# EAGLE schematic pcb1_24V (EAGLE 9.6.2)
Assembly variants: ECU Type I non terminated, b

## Sheet 1 of 6
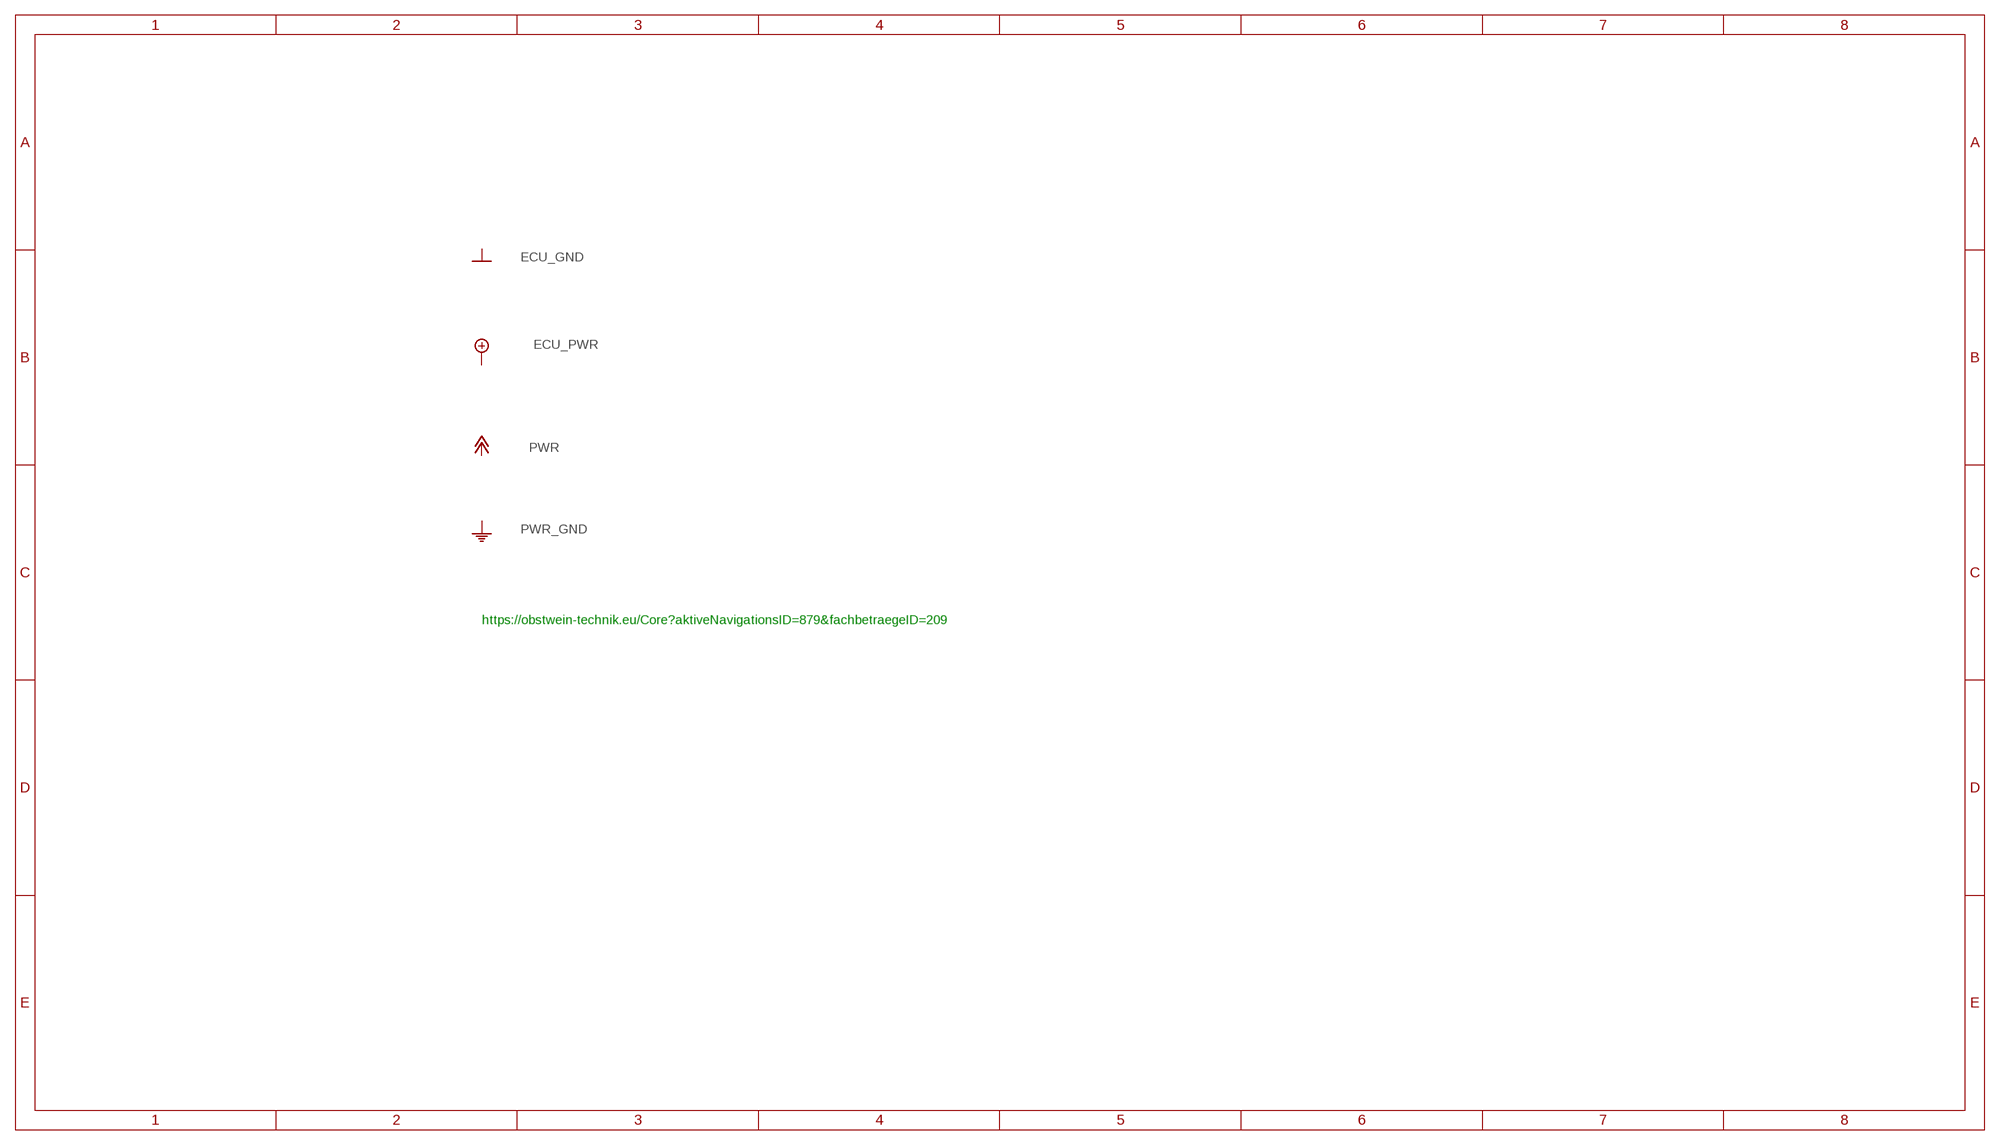
[diagram p0: schematic, sheet 1]

### Notes on the sheet
- https://obstwein-technik.eu/Core?aktiveNavigationsID=879&fachbetraegeID=209

## Sheet 2 of 6
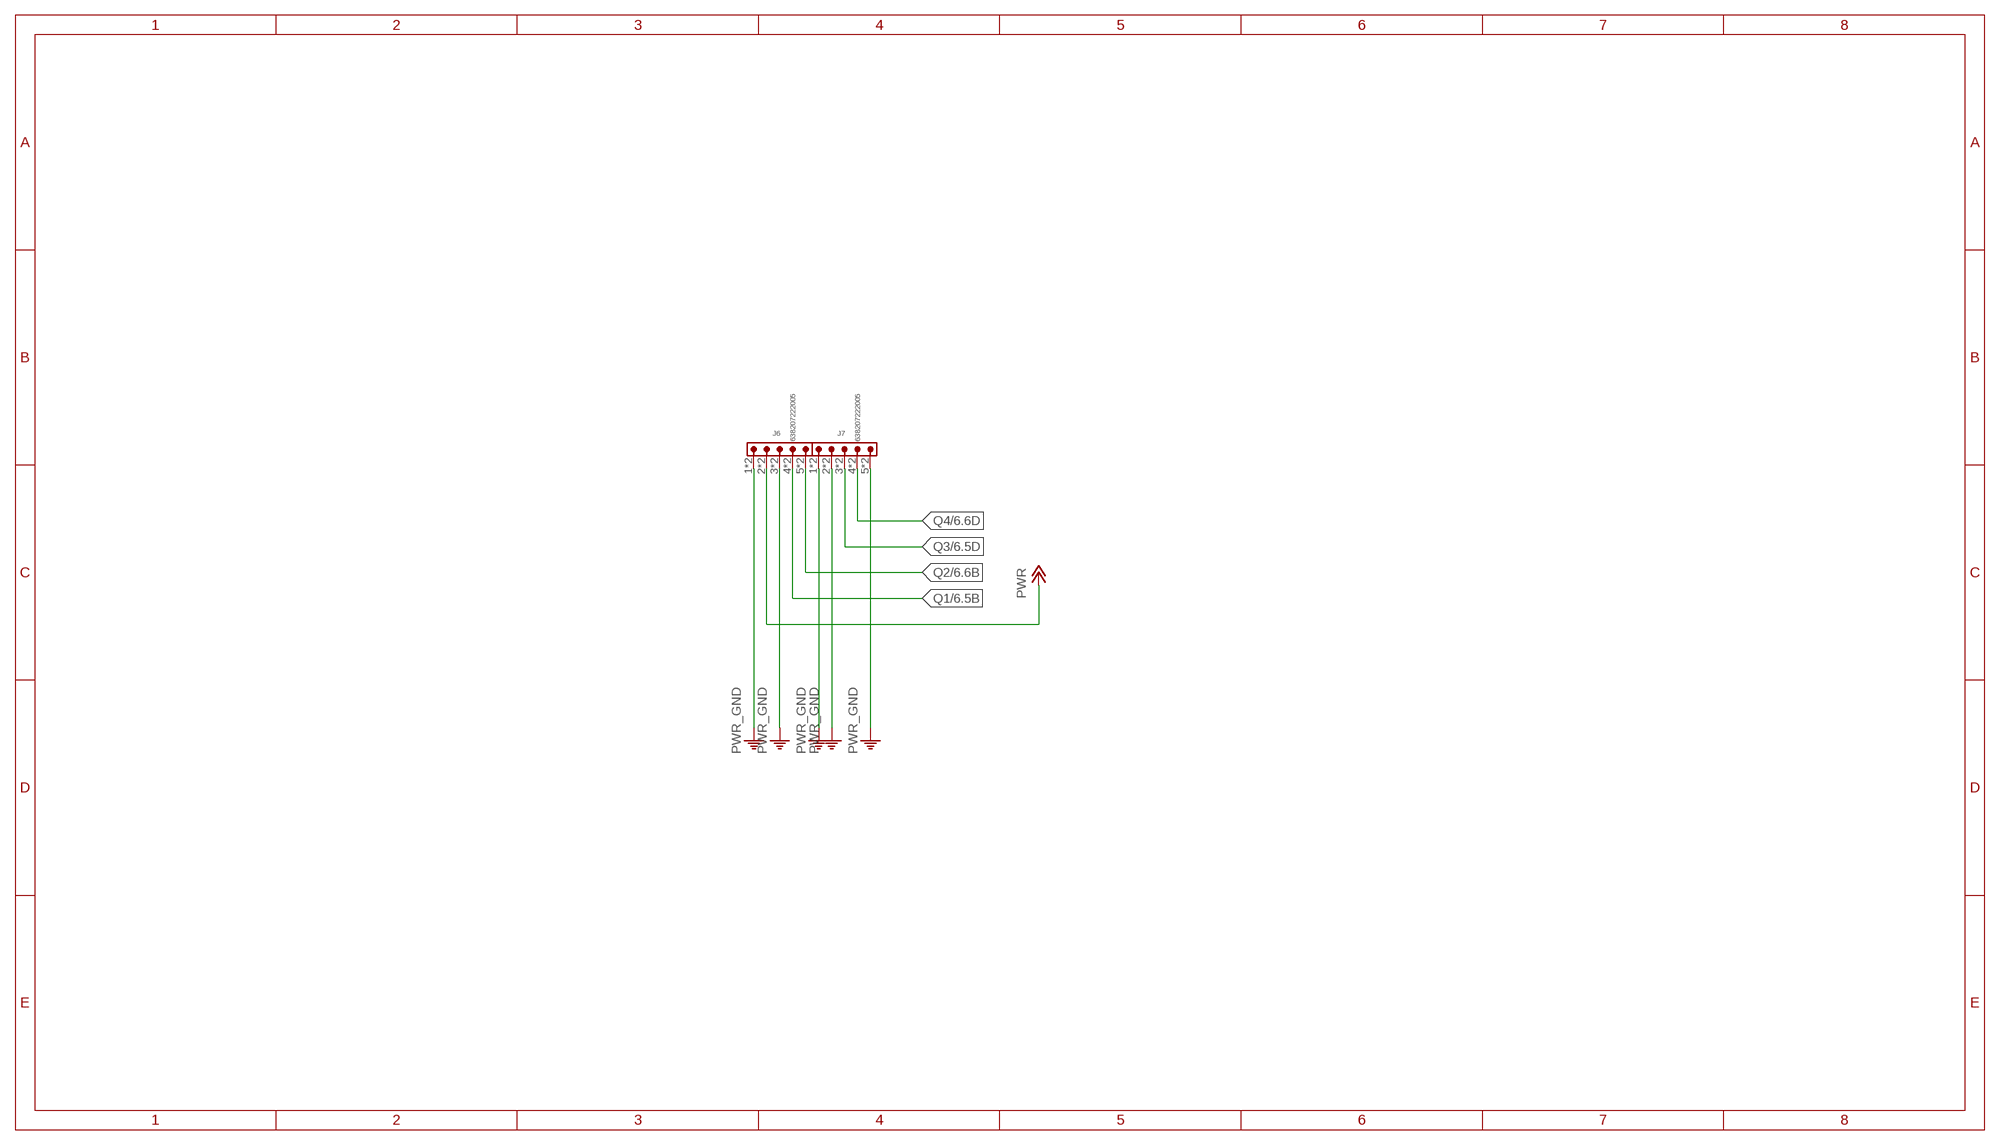
[diagram p1: schematic, sheet 2]

### Parts
J6  638207222005  638207222005  [638207222005]
J7  638207222005  638207222005  [638207222005]

### Nets
PWR: J6.2 J6.A2 ; also sheet 6
PWR_GND: J6.1 J6.3 J6.A1 J6.A3 J7.1 J7.2 J7.5 J7.A1 J7.A2 J7.A5 ; also sheet 6
Q1: J6.4 J6.A4 ; also sheet 6
Q2: J6.5 J6.A5 ; also sheet 6
Q3: J7.3 J7.A3 ; also sheet 6
Q4: J7.4 J7.A4 ; also sheet 6

## Sheet 3 of 6
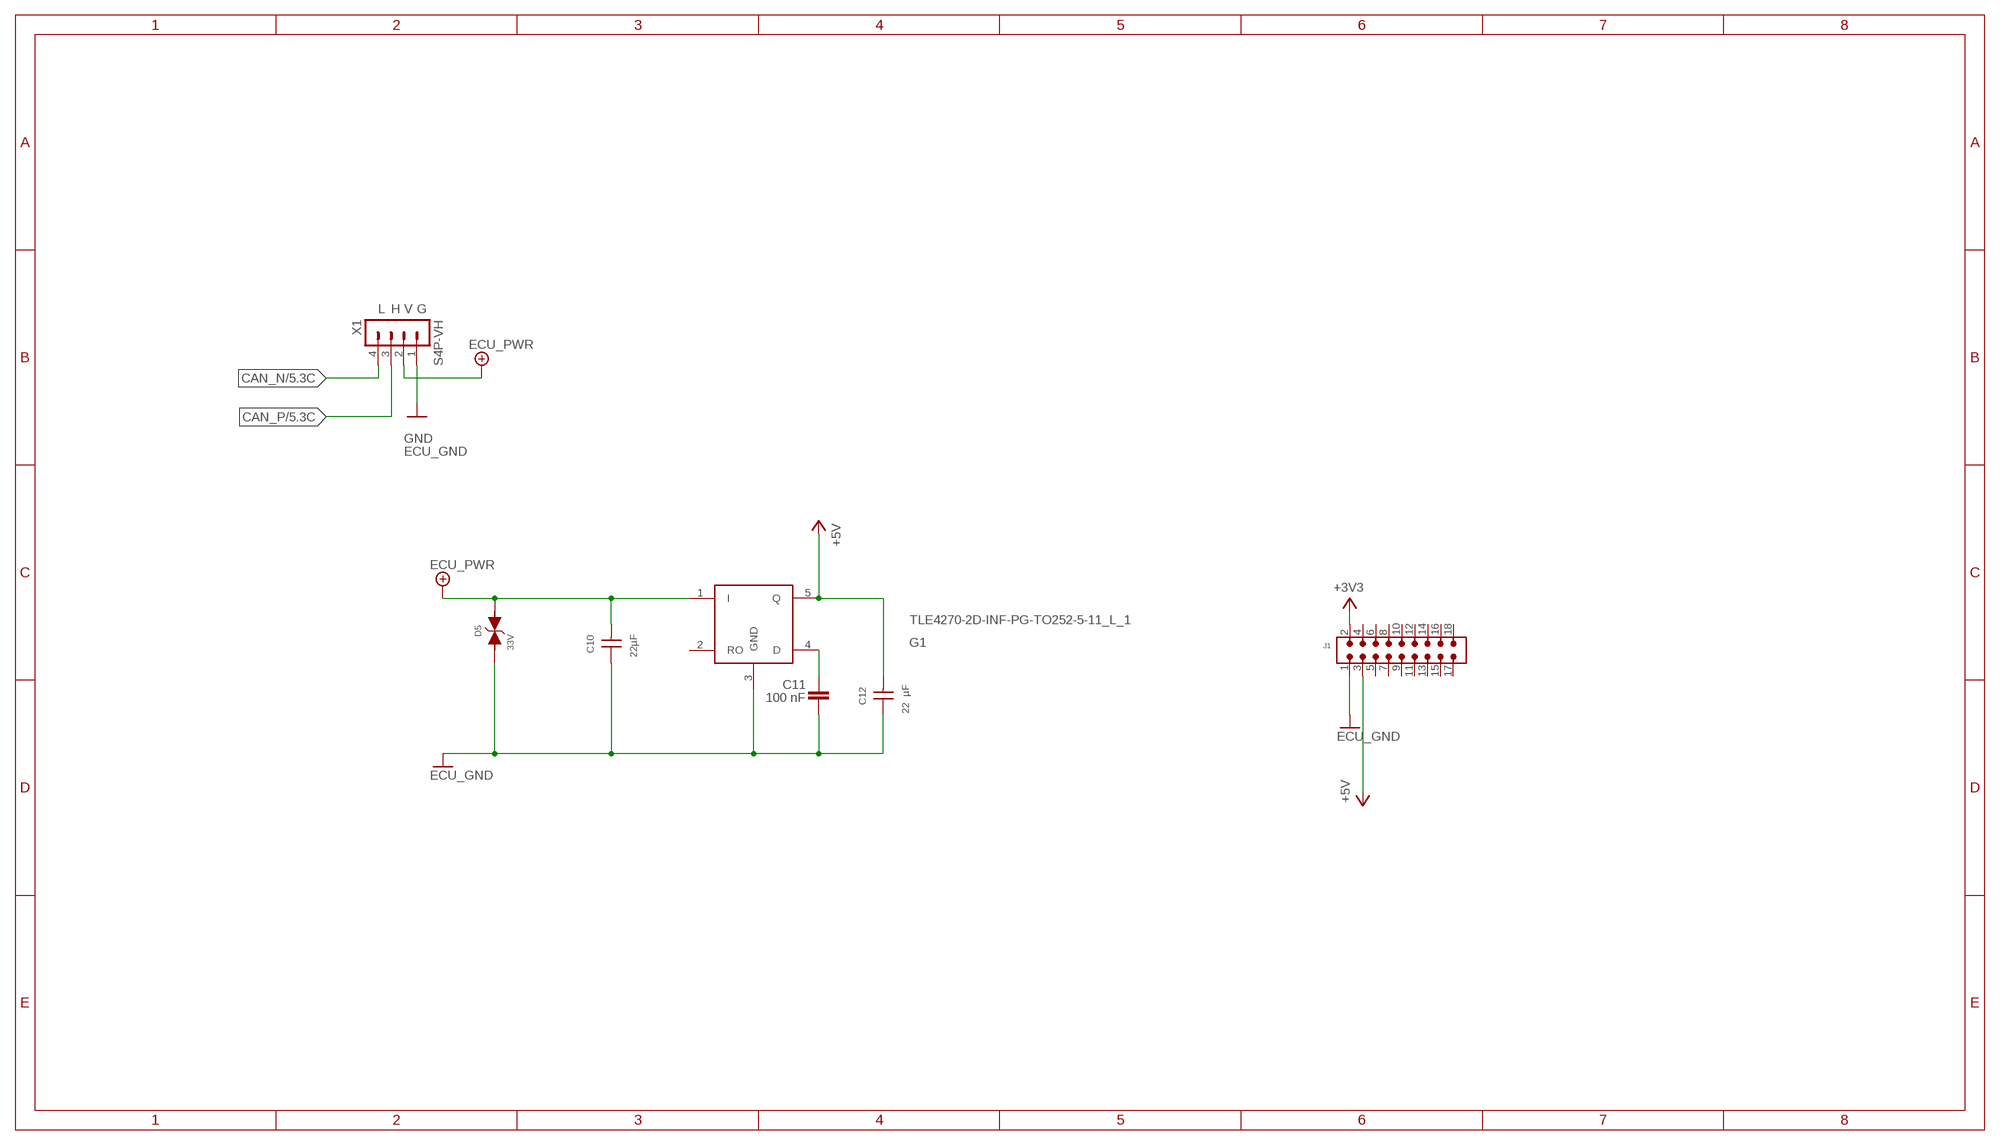
[diagram p2: schematic, sheet 3]

### Parts
C10  22µF  WCAP-CSGP_1210_H2.5_885012109014_25V(DC)  [WCAP-CSGP_1210_H2.5]
C11  100 nF  WCAP-CSGP_0402_885012205037_16V(DC)  [WCAP-CSGP_0402]
C12  22 µF  WCAP-CSGP_0805_H1.25_885012107011_10V(DC)  [WCAP-CSGP_0805_H1.25_R]
D5  33V  WE-TVSP_DO-214AB_3000W_BI_824551331  [WE-TVSP_DO-214AB_BIDIRECTIONAL]
G1  TLE4270-2D-INF-PG-TO252-5-11_L_1  [INF-PG-TO252-5-11_L_1PRIMARY]
J1  6130XX21121_61301821121  [61301821121]
X1  S4P-VH  [S4P-VH]

### Nets
+3V3: J1.2 ; also sheet 4,5
+5V: C12.2 G1.5(Q) J1.3 ; also sheet 4,5
CAN_N: X1.4 ; also sheet 5
CAN_P: X1.3 ; also sheet 5
ECU_GND [GND]: C10.1 C11.2 C12.1 D5.1 G1.3(GND) J1.1 X1.1 ; supply symbol labelled GND ; also sheet 4,5,6
ECU_PWR: C10.2 D5.2 G1.1(I) X1.2 ; also sheet 6
N$7: C11.1 G1.4(D)
Unconnected: G1.2(RO) J1.4 J1.5 J1.6 J1.7 J1.8 J1.9 J1.10 J1.11 J1.12 J1.13 J1.14 J1.15 J1.16 J1.17 J1.18

### Notes on the sheet
- L | H | V | G

## Sheet 4 of 6
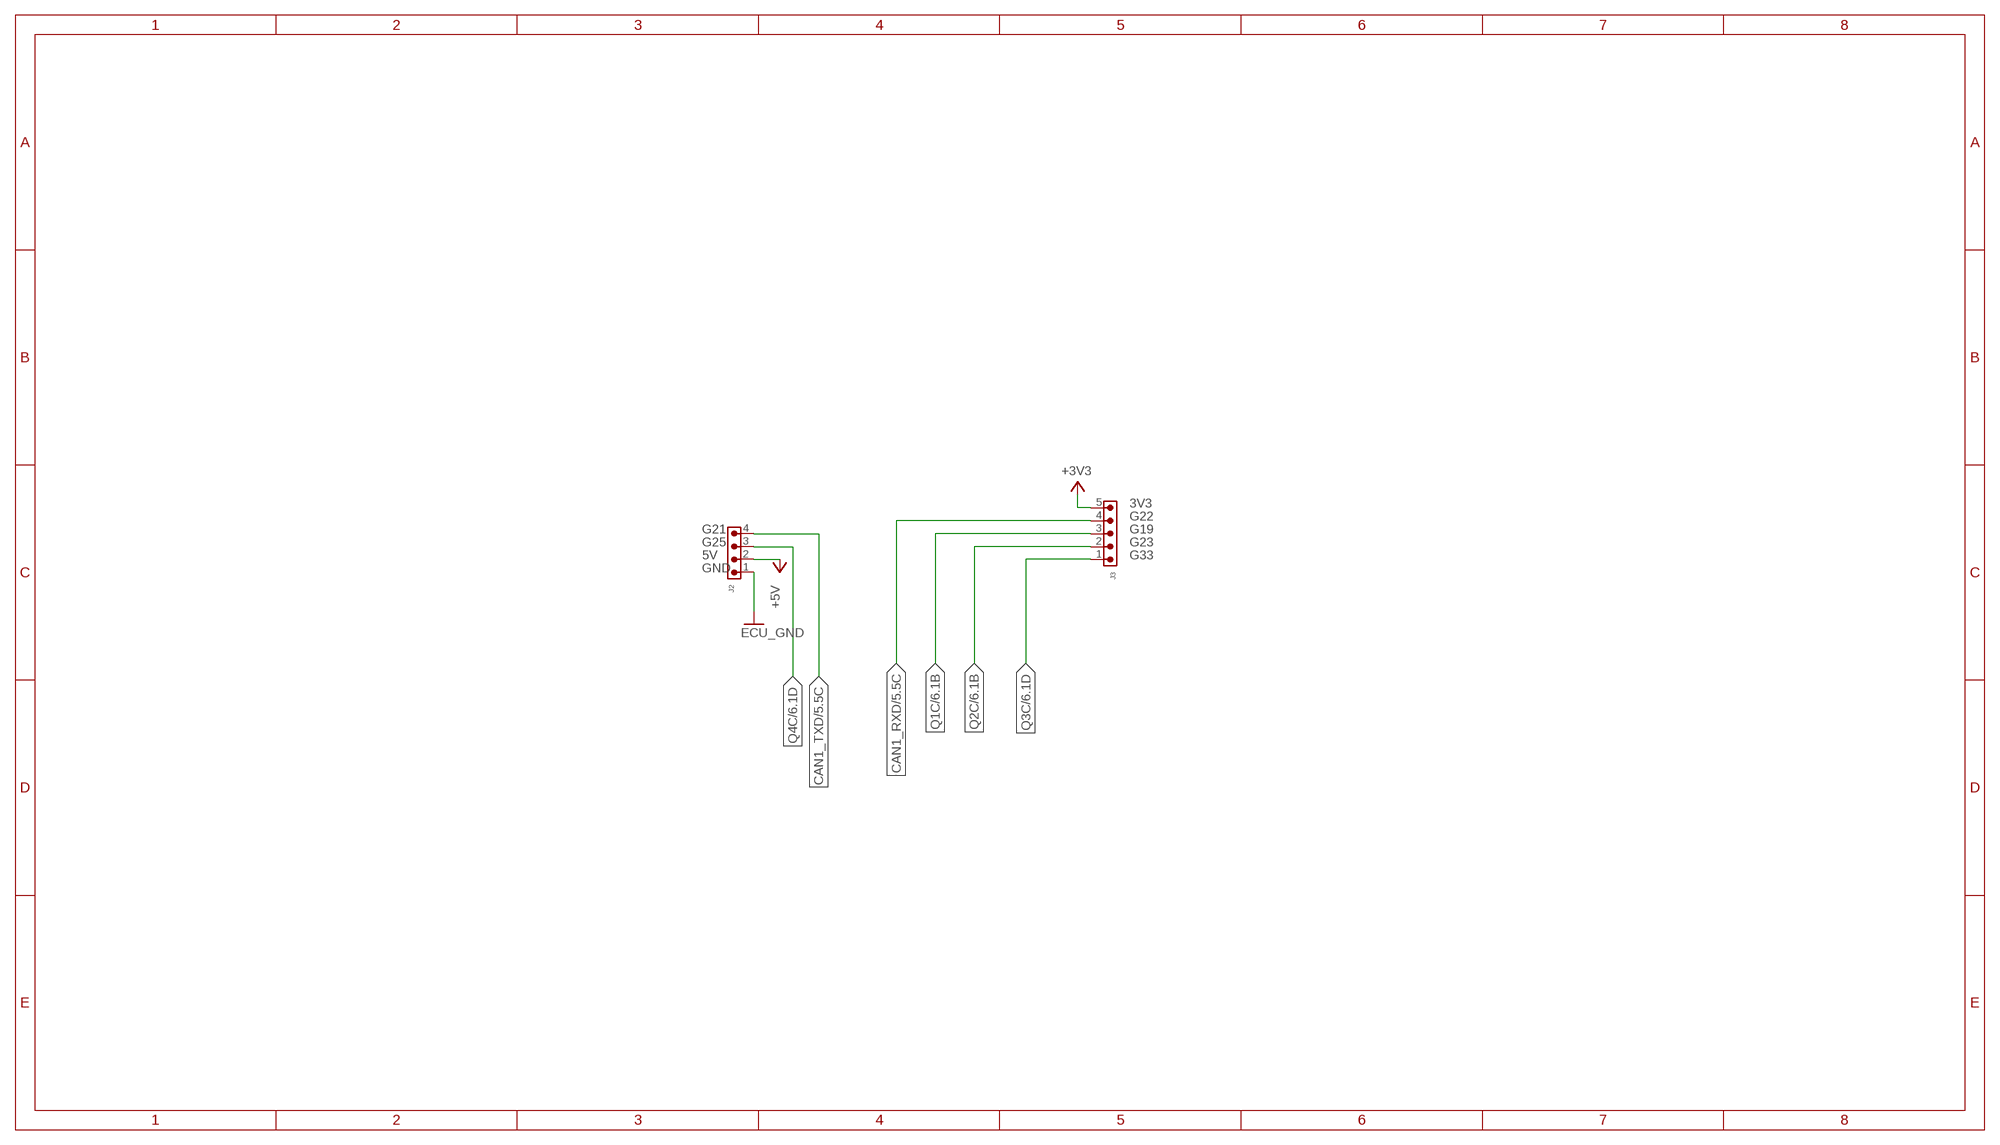
[diagram p3: schematic, sheet 4]

### Parts
J2  6130XX11121_61300411121  [61300411121]
J3  6130XX11121_61300511121  [61300511121]

### Nets
+3V3: J3.5 ; also sheet 3,5
+5V: J2.2 ; also sheet 3,5
CAN1_RXD: J3.4 ; also sheet 5
CAN1_TXD: J2.4 ; also sheet 5
ECU_GND [GND]: J2.1 ; also sheet 3,5,6
Q1C: J3.3 ; also sheet 6
Q2C: J3.2 ; also sheet 6
Q3C: J3.1 ; also sheet 6
Q4C: J2.3 ; also sheet 6

### Notes on the sheet
- 3V3
- G22
- G21 | G19
- G25 | G23
- 5V | G33
- GND

## Sheet 5 of 6
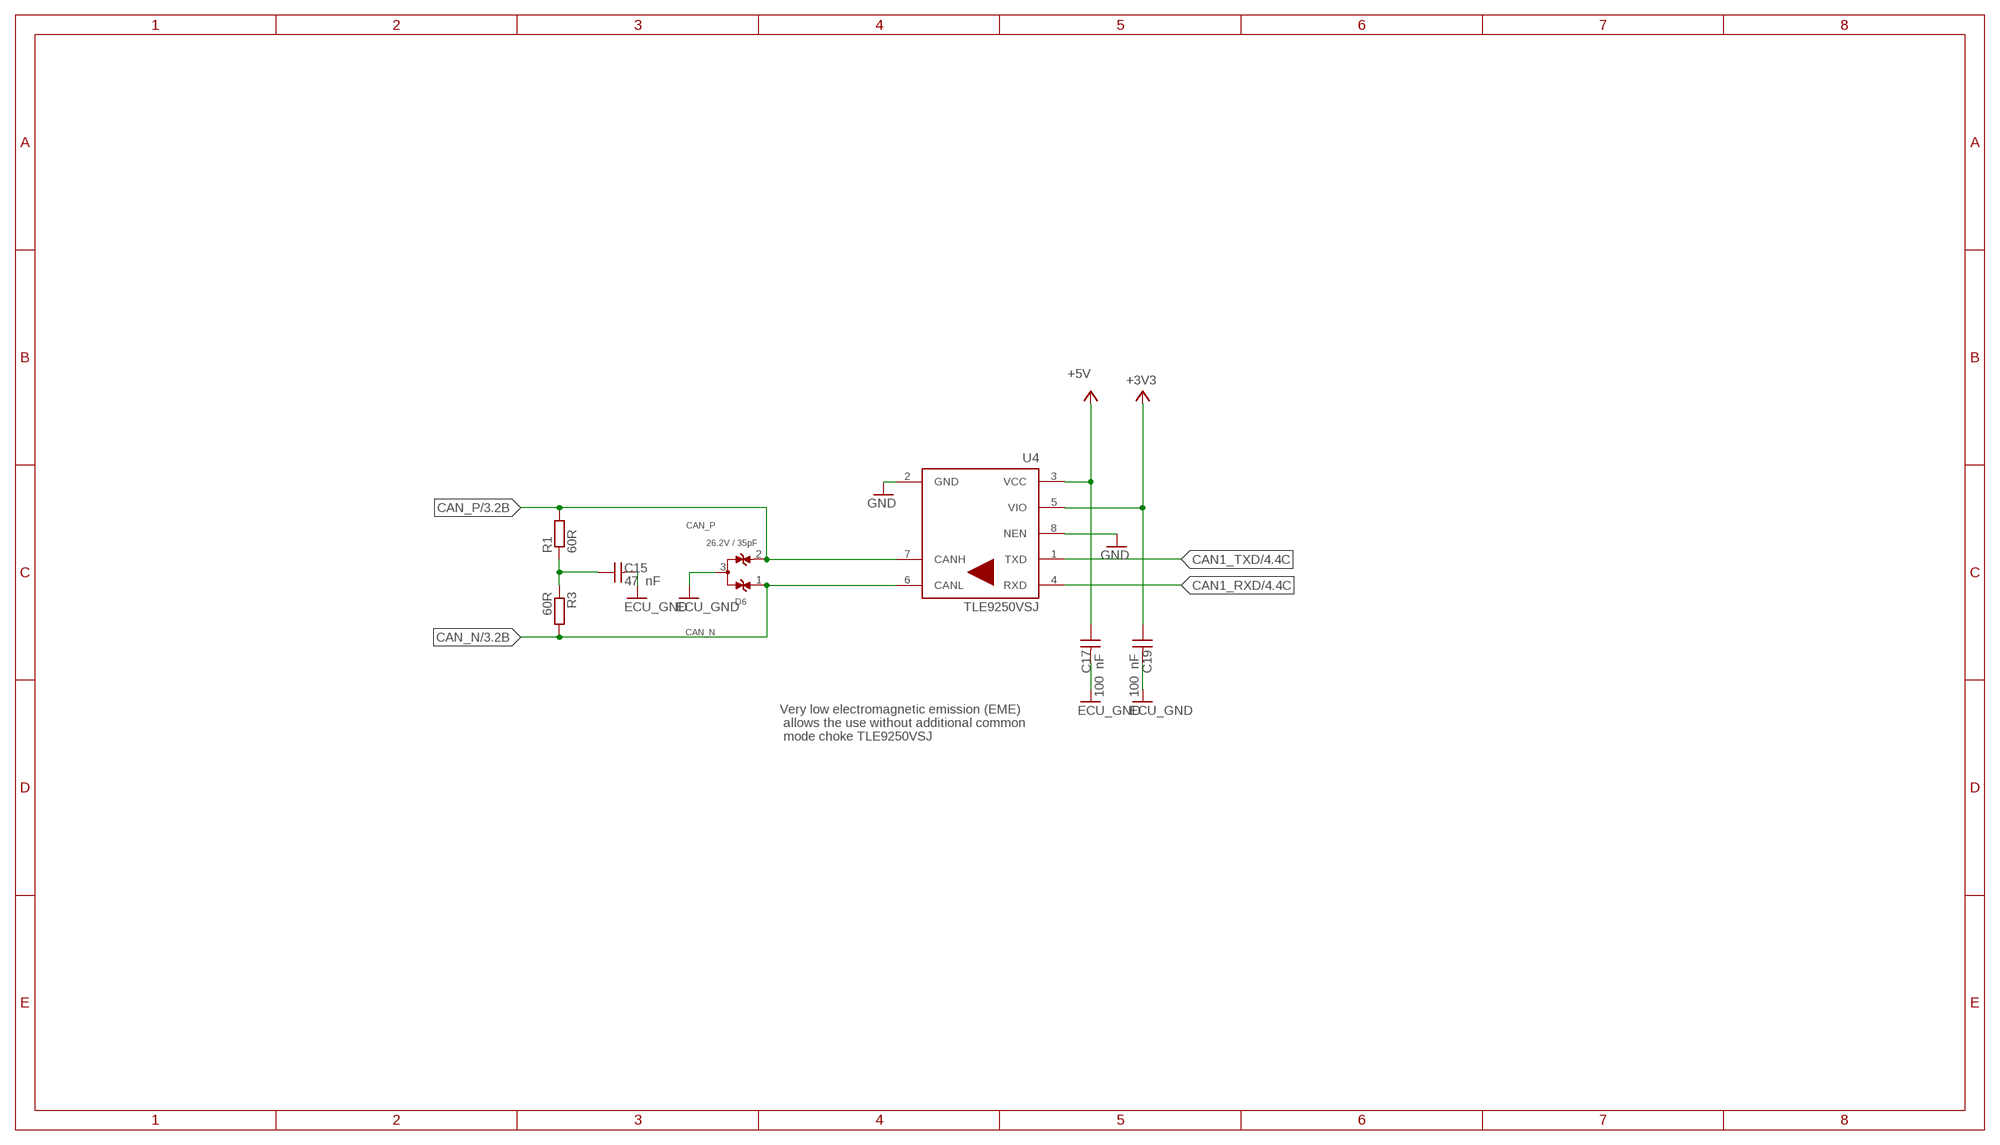
[diagram p4: schematic, sheet 5]

### Parts
C15  47 nF  WCAP-CSGP_0805_H0.8_885012207096_50V(DC)_R  [WCAP-CSGP_0805_H0.8_R]
C17  100 nF  WCAP-CSGP_0805_H0.8_885012207098_50V(DC)_R  [WCAP-CSGP_0805_H0.8_R]
C19  100 nF  WCAP-CSGP_0805_H0.8_885012207098_50V(DC)_R  [WCAP-CSGP_0805_H0.8_R]
D6  26.2V / 35pF  WE-TVS_SOT23-3L_824098024  [WE-TVS_SOT23-3L]
R1  60R  R-EU_R0805  [R0805]
R3  60R  R-EU_R0805  [R0805]
U4  TLE9250VSJ  [SOIC127P602X173-8N-V]

### Nets
+3V3: C19.1 U4.5(VIO) ; also sheet 3,4
+5V: C17.1 U4.3(VCC) ; also sheet 3,4
CAN1_RXD: U4.4(RXD) ; also sheet 4
CAN1_TXD: U4.1(TXD) ; also sheet 4
CAN_N: D6.1 R3.2 U4.6(CANL) ; also sheet 3
CAN_P: D6.2 R1.2 U4.7(CANH) ; also sheet 3
ECU_GND [GND]: C15.2 C17.2 C19.2 D6.3 U4.2(GND) U4.8(NEN) ; supply symbol labelled GND ; also sheet 3,4,6
N$17: C15.1 R1.1 R3.1

### Notes on the sheet
- Very low electromagnetic emission (EME)
   allows the use without additional common
   mode choke TLE9250VSJ

## Sheet 6 of 6
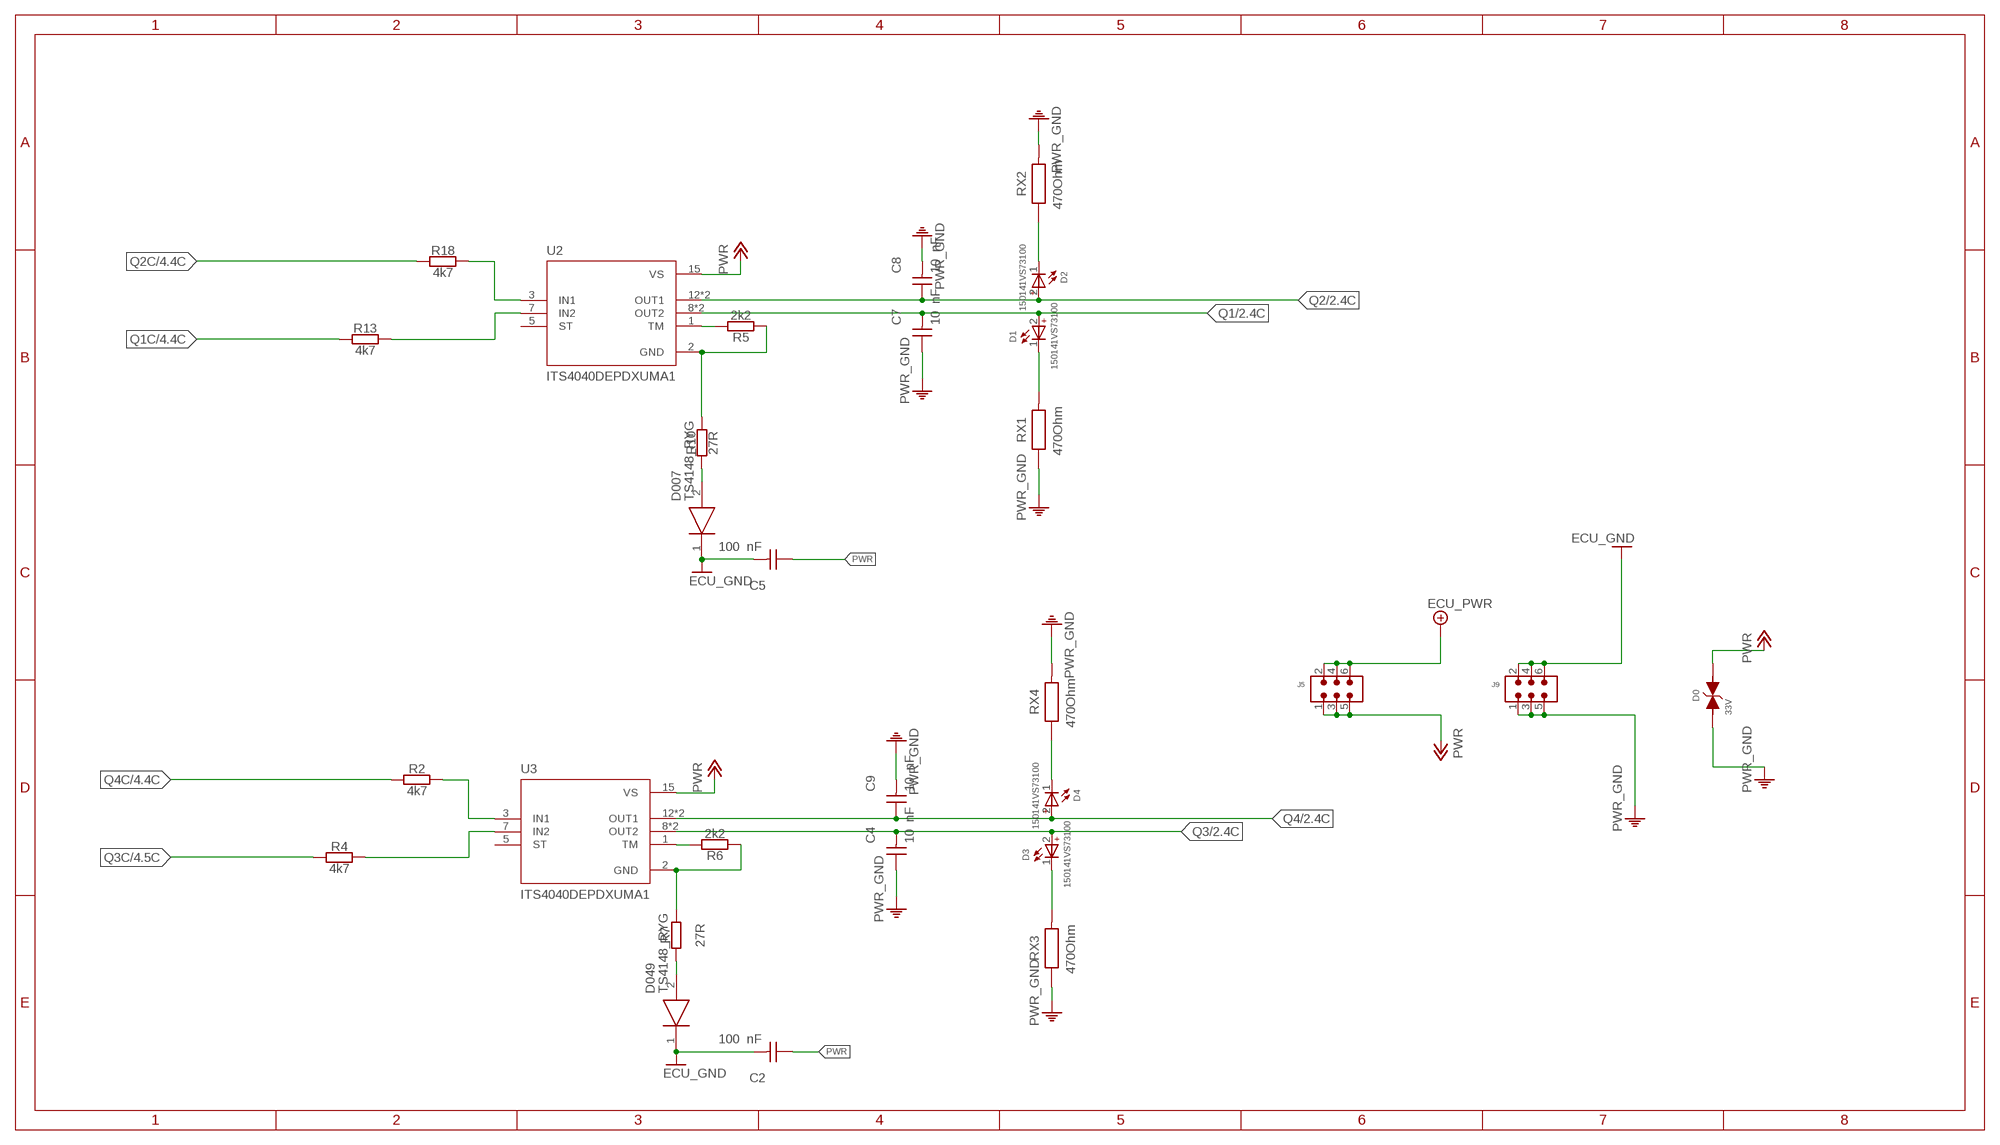
[diagram p5: schematic, sheet 6]

### Parts
C2  100 nF  WCAP-CSGP_0805_H0.8_885012207098_50V(DC)_R  [WCAP-CSGP_0805_H0.8_R]
C4  10 nF  WCAP-CSGP_0805_H0.8_885012207092_50V(DC)_R  [WCAP-CSGP_0805_H0.8_R]
C5  100 nF  WCAP-CSGP_0805_H0.8_885012207098_50V(DC)_R  [WCAP-CSGP_0805_H0.8_R]
C7  10 nF  WCAP-CSGP_0805_H0.8_885012207092_50V(DC)_R  [WCAP-CSGP_0805_H0.8_R]
C8  10 nF  WCAP-CSGP_0805_H0.8_885012207092_50V(DC)_R  [WCAP-CSGP_0805_H0.8_R]
C9  10 nF  WCAP-CSGP_0805_H0.8_885012207092_50V(DC)_R  [WCAP-CSGP_0805_H0.8_R]
D0  33V  WE-TVSP_DO-214AB_3000W_BI_824551331  [WE-TVSP_DO-214AB_BIDIRECTIONAL]
D1  150141VS73100  WL-SMTW_3528_150141VS73100  [WL-SMTW_3528]
D2  150141VS73100  WL-SMTW_3528_150141VS73100  [WL-SMTW_3528]
D3  150141VS73100  WL-SMTW_3528_150141VS73100  [WL-SMTW_3528]
D4  150141VS73100  WL-SMTW_3528_150141VS73100  [WL-SMTW_3528]
D007  TS4148_RYG  [DIOC2012X95N]
D049  TS4148_RYG  [DIOC2012X95N]
J5  6130XX21121_61300621121  [61300621121]
J9  6130XX21121_61300621121  [61300621121]
R2  4k7  R-EU_R0805  [R0805]
R4  4k7  R-EU_R0805  [R0805]
R5  2k2  R-EU_R0805  [R0805]
R6  2k2  R-EU_R0805  [R0805]
R7  27R  R-EU_R0805  [R0805]
R10  27R  R-EU_R0805  [R0805]
R13  4k7  R-EU_R0805  [R0805]
R18  4k7  R-EU_R0805  [R0805]
RX1  470Ohm  WRIS-KWKB_0612_561020132023  [WRIS-KWKB_0612]
RX2  470Ohm  WRIS-KWKB_0612_561020132023  [WRIS-KWKB_0612]
RX3  470Ohm  WRIS-KWKB_0612_561020132023  [WRIS-KWKB_0612]
RX4  470Ohm  WRIS-KWKB_0612_561020132023  [WRIS-KWKB_0612]
U2  ITS4040DEPDXUMA1  [SOP65P600X115-15N]
U3  ITS4040DEPDXUMA1  [SOP65P600X115-15N]

### Nets
ECU_GND [GND]: C2.2 C5.2 D007.1(K) D049.1(K) J9.2 J9.4 J9.6 ; also sheet 3,4,5
ECU_PWR: J5.2 J5.4 J5.6 ; also sheet 3
N$1 [GND]: D4.1(-) RX4.1
N$2: R2.2 U3.3(IN1)
N$3: R6.2 U3.1(TM)
N$4: R4.2 U3.7(IN2)
N$5: R5.2 U2.1(TM)
N$6 [GND]: D2.1(-) RX2.1
N$8 [GND]: D1.1(-) RX1.2
N$9 [GND]: D3.1(-) RX3.2
N$10: R18.2 U2.3(IN1)
N$11 [GND]: D049.2(A) R7.1
N$12: D007.2(A) R10.1
N$13: R6.1 R7.2 U3.2(GND)
N$14: R13.2 U2.7(IN2)
N$15: R5.1 R10.2 U2.2(GND)
PWR: C2.1 C5.1 D0.2 J5.1 J5.3 J5.5 U2.15(VS) U3.15(VS) ; also sheet 2
PWR_GND: C4.1 C7.1 C8.2 C9.2 D0.1 J9.1 J9.3 J9.5 RX1.1 RX2.2 RX3.1 RX4.2 ; also sheet 2
Q1: C7.2 D1.2(+) U2.8(OUT2) U2.10(OUT2) ; also sheet 2
Q1C: R13.1 ; also sheet 4
Q2: C8.1 D2.2(+) U2.12(OUT1) U2.14(OUT1) ; also sheet 2
Q2C: R18.1 ; also sheet 4
Q3: C4.2 D3.2(+) U3.8(OUT2) U3.10(OUT2) ; also sheet 2
Q3C: R4.1 ; also sheet 4
Q4: C9.1 D4.2(+) U3.12(OUT1) U3.14(OUT1) ; also sheet 2
Q4C: R2.1 ; also sheet 4
Unconnected: U2.5(ST) U3.5(ST)

## Library data of the parts
C2 C5 C17 C19 = Wurth_Capacitors_WCAP-CSGP:WCAP-CSGP_0805_H0.8: WCAP-CSGP MLCCs 0805 General Purpose Characteristics General purpose product series High performance ceramic High electrical precision and stability ceramic especially for NP0 Minimal aging especially for NP0 Mounting style: SMT-Chip Ceramic: NP0 (Class I), X5R (Class II), X7R (Class II) Capacitance range: 1 pF ‒ 47 μF Temperature Coefficient: ±30 ppm/°C; ±0.54 % for NP0 ±15 % for X7R and X5R Voltage range (UR): 6.3 ‒ 100 V(DC) Operating temperature: -55 °C up to + 125 °C for NP0 and X7R -55 °C up to + 85 °C for X5R Termination: Cu/Ni/Sn Recommended soldering: Reflow soldering Wave soldering (only valid for the thickness ≤1.00 mm) for NP0 and X7R Applications TTemperature compensation (NP0) Coupling Decoupling Bypass Smoothing Filtering Resonant circuit <https://www.we-online.com/catalog/media/o166500v209%20Family_WE-MLCC_0805_grau.jpg> Details see: https://www.we-online.com/catalog/en/WCAP-CSGP-0805/ Updated by yingchun,Shan;2020-03-09 2020(C) Würth Elektronik; CERAMIC-TYPE: X7R Class II; DATASHEET-URL: https://www.we-online.com/catalog/datasheet/885012207098.pdf; DF: 0.025; H: 0.8mm; OPERATING-TEMPERATURE: -55 °C up to +125 °C; PART-NUMBER: 885012207098; QMIN: -; RISO: 5GOhm; TECHNICAL-REFERENCE: X7R0805104K050DFCT10000; TOL-VALUE: ±10%; VR: 50V(DC)
C4 C7-C9 = Wurth_Capacitors_WCAP-CSGP:WCAP-CSGP_0805_H0.8: WCAP-CSGP MLCCs 0805 General Purpose Characteristics General purpose product series High performance ceramic High electrical precision and stability ceramic especially for NP0 Minimal aging especially for NP0 Mounting style: SMT-Chip Ceramic: NP0 (Class I), X5R (Class II), X7R (Class II) Capacitance range: 1 pF ‒ 47 μF Temperature Coefficient: ±30 ppm/°C; ±0.54 % for NP0 ±15 % for X7R and X5R Voltage range (UR): 6.3 ‒ 100 V(DC) Operating temperature: -55 °C up to + 125 °C for NP0 and X7R -55 °C up to + 85 °C for X5R Termination: Cu/Ni/Sn Recommended soldering: Reflow soldering Wave soldering (only valid for the thickness ≤1.00 mm) for NP0 and X7R Applications TTemperature compensation (NP0) Coupling Decoupling Bypass Smoothing Filtering Resonant circuit <https://www.we-online.com/catalog/media/o166500v209%20Family_WE-MLCC_0805_grau.jpg> Details see: https://www.we-online.com/catalog/en/WCAP-CSGP-0805/ Updated by yingchun,Shan;2020-03-09 2020(C) Würth Elektronik; CERAMIC-TYPE: X7R Class II; DATASHEET-URL: https://www.we-online.com/catalog/datasheet/885012207092.pdf; DF: 0.025; H: 0.8mm; OPERATING-TEMPERATURE: -55 °C up to +125 °C; PART-NUMBER: 885012207092; QMIN: -; RISO: 10GOhm; TECHNICAL-REFERENCE: X7R0805103K050DFCT10000; TOL-VALUE: ±10%; VR: 50V(DC)
C10 = Wurth_Capacitors_WCAP-CSGP:WCAP-CSGP_1210_H2.5: WCAP-CSGP MLCCs 1210 General Purpose Characteristics General purpose product series High performance ceramic High electrical precision and stability ceramic especially for NP0 Minimal aging especially for NP0 Mounting style: SMT-Chip Ceramic: NP0 (Class I), X5R (Class II), X7R (Class II) Capacitance range: 22 pF ‒ 100 µF Temperature Coefficient: ±30 ppm/°C; ±0.54 % for NP0 ±15 % for X7R and X5R Voltage range (UR): 6.3 ‒ 100 V(DC) Operating temperature: -55 °C up to + 125 °C for NP0 and X7R -55 °C up to + 85 °C for X5R Termination: Cu/Ni/Sn Recommended soldering: Reflow soldering Applications Temperature compensation (NP0) Coupling Decoupling Bypass Smoothing Filtering Resonant circuit <https://www.we-online.com/catalog/media/o166502v209%20Family_WE-MLCC_1210.jpg> Details see: https://www.we-online.com/catalog/en/WCAP-CSGP-1210/ Updated by yingchun,Shan;2020-03-09 2020(C) Würth Elektronik; CERAMIC-TYPE: X5R Class II; DATASHEET-URL: https://www.we-online.com/catalog/datasheet/885012109014.pdf; DF: 0.05; H: 2.5mm; OPERATING-TEMPERATURE: -55 °C up to +85 °C; PART-NUMBER: 885012109014; QMIN: -; RISO: 0,005G Ohm; TECHNICAL-REFERENCE: X5R1210226M025DFCT10000; TOL-VALUE: ±20%; VR: 25V(DC)
C11 = fliegl-wuerth:WCAP-CSGP_0402: WCAP-CSGP MLCCs 0402 General Purpose Characteristics High performance ceramic High electrical precision and stability ceramic especially for NP0 Minimal aging especially for NP0 Mounting style: SMT-Chip Ceramic: NP0 (Class I), X5R (Class II), X7R (Class II) Capacitance range: 1 pF ‒ 10 µF Temperature Coefficient: ±30 ppm/°C; ±0.54 % for NP0 ±15 % for X5R and X7R Voltage range (UR): 6.3 ‒ 100 V(DC) Operating temperature: -55 °C up to + 125 °C for NP0 and X7R -55 °C up to + 85 °C for X5R Termination: Cu/Ni/Sn Recommended soldering: Reflow soldering Applications Temperature compensation (NP0) Coupling Decoupling Bypass Smoothing Filtering Resonant circuit <https://www.we-online.com/catalog/media/o157810v209%20Family_WE-MLCC_0805_weiss.jpg> Details see: https://www.we-online.com/catalog/en/WCAP-CSGP-0402/ Updated by yingchun,Shan;2020-03-06 2020(C) Würth Elektronik; ARTIKEL_NR: 545504; CERAMIC-TYPE: X7R Class II; PART-NUMBER: 885012205037; TOL-VALUE: ±10%; VR: 16V(DC)
C12 = Wurth_Capacitors_WCAP-CSGP:WCAP-CSGP_0805_H1.25: WCAP-CSGP MLCCs 0805 General Purpose Characteristics General purpose product series High performance ceramic High electrical precision and stability ceramic especially for NP0 Minimal aging especially for NP0 Mounting style: SMT-Chip Ceramic: NP0 (Class I), X5R (Class II), X7R (Class II) Capacitance range: 1 pF ‒ 47 μF Temperature Coefficient: ±30 ppm/°C; ±0.54 % for NP0 ±15 % for X7R and X5R Voltage range (UR): 6.3 ‒ 100 V(DC) Operating temperature: -55 °C up to + 125 °C for NP0 and X7R -55 °C up to + 85 °C for X5R Termination: Cu/Ni/Sn Recommended soldering: Reflow soldering Wave soldering (only valid for the thickness ≤1.00 mm) for NP0 and X7R Applications TTemperature compensation (NP0) Coupling Decoupling Bypass Smoothing Filtering Resonant circuit <https://www.we-online.com/catalog/media/o166500v209%20Family_WE-MLCC_0805_grau.jpg> Details see: https://www.we-online.com/catalog/en/WCAP-CSGP-0805/ Updated by Ella Wu 2021-02-03 2021(C) Würth Elektronik; CERAMIC-TYPE: X5R Class II; DATASHEET-URL: https://www.we-online.com/catalog/datasheet/885012107011.pdf; DF: 0.1; H: 1.25mm; OPERATING-TEMPERATURE: -55 °C up to +85 °C; PART-NUMBER: 885012107011; QMIN: -; RISO: 0,005GOhm; TECHNICAL-REFERENCE: X5R0805226M010DFCT10000; TOL-VALUE: ±20%; VR: 10V(DC)
C15 = Wurth_Capacitors_WCAP-CSGP:WCAP-CSGP_0805_H0.8: WCAP-CSGP MLCCs 0805 General Purpose Characteristics General purpose product series High performance ceramic High electrical precision and stability ceramic especially for NP0 Minimal aging especially for NP0 Mounting style: SMT-Chip Ceramic: NP0 (Class I), X5R (Class II), X7R (Class II) Capacitance range: 1 pF ‒ 47 μF Temperature Coefficient: ±30 ppm/°C; ±0.54 % for NP0 ±15 % for X7R and X5R Voltage range (UR): 6.3 ‒ 100 V(DC) Operating temperature: -55 °C up to + 125 °C for NP0 and X7R -55 °C up to + 85 °C for X5R Termination: Cu/Ni/Sn Recommended soldering: Reflow soldering Wave soldering (only valid for the thickness ≤1.00 mm) for NP0 and X7R Applications TTemperature compensation (NP0) Coupling Decoupling Bypass Smoothing Filtering Resonant circuit <https://www.we-online.com/catalog/media/o166500v209%20Family_WE-MLCC_0805_grau.jpg> Details see: https://www.we-online.com/catalog/en/WCAP-CSGP-0805/ Updated by yingchun,Shan;2020-03-09 2020(C) Würth Elektronik; CERAMIC-TYPE: X7R Class II; DATASHEET-URL: https://www.we-online.com/catalog/datasheet/885012207096.pdf; DF: 0.025; H: 0.8mm; OPERATING-TEMPERATURE: -55 °C up to +125 °C; PART-NUMBER: 885012207096; QMIN: -; RISO: 10GOhm; TECHNICAL-REFERENCE: X7R0805473K050DFCT10000; TOL-VALUE: ±10%; VR: 50V(DC)
D0 D5 = Wurth_EMC Components_WE-TVSP:WE-TVSP_DO-214AB_3000W_BI: WE-TVSP Power TVS Diode Characteristics Low Profile Package Glass passivated Juction Excellent clamping capability Fast response time MSL Level 1, per J-STD-020 Classification of the plastic case: UL 94 V-0 Safety certification UL 497B, E478010 Identical design: - DO-214AC = SMAJ - DO-214AA = SMBJ - DO-214AB = SMCJ/SMDJ Applications Ideal to protect the I/O Interfaces, Bus Voltage and other circuits of sensetive electronic equipment against voltage transiensts <https://www.we-online.com/catalog/media/o55793v209%20WE-TVSP_600W-3000W_D0214AA_4C.jpg> Details see: https://www.we-online.com/catalog/en/WE-TVSP/ Updated by Ella Wu 2020-07-20 2020 (C) Würth Elektronik; DATASHEET-URL: https://www.we-online.com/catalog/datasheet/824551331.pdf; IPEAK: 56.3A; MOUNT: SMT; PART-NUMBER: 824551331; PDISS: 3000W; VBR: 38.65V; VCLAMP: 53.3V
D1-D4 = Wurth_LEDs_WL-SMTW:WL-SMTW_3528: WL-SMTW SMT Mono-color TOP LED Waterclear Characteristics Low energy consumption High reliability Low current requirement Fast switching No UV/IR radiation Slim Miniature size Flexibility in design Top view LED PLCC 2 white package Compact package outline, ideal for miniature applications Variety of colors Applications Signage and indirect illumination Flat lamp Indicator and backlight in telecommunication Consumer application: dash-board, telephone or A/V equipments Flat backlight for LCDs, switches and symbols Optical indicators Indoor and outdoor displays Scanner Backlight in LCD, cellular phones, switches, keys, displays lluminated advertising, panel Lighting device: indicator, general lighting Camera flash, hand carrier flash Coupling into light guides <https://www.we-online.com/catalog/media/o14908v209%20WL-SMTW_150285BSxxx.jpg> Details see: https://www.we-online.com/catalog/en/WL-SMTW/ Updated by Yingchun Shan,2020-03-20 2020(C) Wurth Elektronik; CHIP-TECHNOLOGY: AlInGaP; DATASHEET-URL: https://www.we-online.com/catalog/datasheet/150141VS73100.pdf; EMITTING-COLOR: Bright Green; I-V-TYP: 90mcd; LAMDA-DOM-TYP: 570nm; LAMDA-PEAK-TYP: 572nm; PART-NUMBER: 150141VS73100; PHI-V-TYP: -; V-F-TYP: 2V; VIEWING-ANGLE: 120°
D6 = fliegl-wuerth:WE-TVS_SOT23-3L_824098024: WE-TVS TVS Diode  Standard Series Characteristics Fast turn-on Low clamping voltage High ESD withstand voltage Uni- or bidirectional protection Small package Epoxy flame resistant UL94 V-0 Applications DC power supply USB Power Delivery (PD) Headsets and accessories PDAs Digital cameras MP3-Player Touch Panels Notebooks ESD, EFT and Surge Protection ESD protection in accordance with EN 61000-4-2  8 kV contact discharge  15 kV air discharge Application Notes ANP024 The USB Interface from EMC Point of View <https://katalog.we-online.de/media/images/v2/Family_WE-TVS_Standard.jpg> Details see: https://katalog.we-online.de/en/pbs/WE-TVS/82402374?m Created By Yingchun,Shan 2018-11-16 2018 (C) Wurth Elektronik; ARTIKEL_NR: 531887; KOMPONENTENNUMMER: 617684; WE-NUMBER: 824098024
D007 D049 = TS4148_RYG:TS4148_RYG: TAIWAN SEMICONDUCTOR - TS4148 RYG - DIODE, SMALL SIGNAL, 75V, 0.15A, 0805 Source: Datasheet <https://componentsearchengine.com/Datasheets/2/TS4148 RYG.pdf>; ALLIED_NUMBER: 70439260; ALLIED_PRICE-STOCK: https://www.alliedelec.com/taiwan-semiconductor-ts4148-ryg/70439260/; DESCRIPTION: TAIWAN SEMICONDUCTOR - TS4148 RYG - DIODE, SMALL SIGNAL, 75V, 0.15A, 0805; HEIGHT: 0.95mm; MANUFACTURER_NAME: Taiwan Semiconductor; MANUFACTURER_PART_NUMBER: TS4148 RYG; MOUSER_PART_NUMBER: 821-TS4148RYG; MOUSER_PRICE-STOCK: https://www.mouser.com/Search/Refine.aspx?Keyword=821-TS4148RYG
G1 = INF-PG-TO252-5-11L:TLE4270-2D-INF-PG-TO252-5-11_L_1
J1 = Wurth_Connectors_WR-PHD:6130XX21121_61301821121: WR-PHD 2.54 mm THT Dual Pin Header ARTICLE PROPERTIES: Pins:4;​ 6;​ 8;​ 10;​ 12;​ 14;​ 16;​ 18;​ 20;​ 22;​ 24;​ 26;​ 28;​ 30;​ 32;​ 34;​ 36;​ 40;​ 44;​ 64;​ 72;​ 80 KIND PROPERTIES: Pitch：2.54 mm Quality Class:3 as per CECC 75 301-802 Rows：Dual Gender：Pin Header Type：Board Stacker MATERIAL PROPERTIES: Insulator Material :PA6T Insulator Flammability Rating:UL94 V-0 Contact Material:Copper Alloy Contact Plating:Gold Contact Type:Stamped GENERAL INFORMATION Operating Temperature:-40 up to +105 °C Compliance:Lead free / RoHS ELECTRICAL PROPERTIES: Rated Current:3 A IR 1:3 A Withstanding Voltage:500 V (AC) Contact Resistance:20 mΩ RISO:1000 MΩ CERTIFICATION UL Approval:E323964 PACKAGING PROPERTIES Packaging:Bag <https://katalog.we-online.com/media/images/v2/o33215v209%20Family_WR-PHD_6130xx21121.jpg> Details see: https://katalog.we-online.com/en/em/PHD_2_54_THT_DUAL_PIN_HEADER_6130XX21121 Updated by Yingchun,Shan 2019-10-16 2019 (C) Würth Elektronik; DATASHEET-URL: https://katalog.we-online.com/em/datasheet/61301821121.pdf; GENDER: Pin Header; IR: 3A; MATES: WR-PHD 2.54mm Angled DualSocket Header/Dual Socket Header/Dual Socket Header Bottom Entry/Dual Socket Header Bottom Entry Large/SMT Dual Socket Header/SMT Dual Socket Header Bottom Entry; PACKAGING: Bag; PART-NUMBER: 61301821121; PINS: 18; ROWS: Dual; TYPE: Board Stacker
J2 = Wurth_Connectors_WR-PHD:6130XX11121_61300411121: WR-PHD 2.54 mm THT Pin Header ARTICLE PROPERTIES: Pins:1;​ 2;​ 3;​ 4;​ 5;​ 6;​ 7;​ 8;​ 9;​ 10;​ 12;​ 13;​ 14;​ 15;​ 16;​ 18;​ 20;​ 22;​ 24;​ 25;​ 32;​ 36;​ 40 KIND PROPERTIES: Pitch：2.54 mm Quality Class:3 as per CECC 75 301-802 Rows：Single Gender：Pin Header Type：Straight MATERIAL PROPERTIES: Insulator Material :PBT Insulator Flammability Rating:UL94 V-0 Contact Material:Copper Alloy Contact Plating:Gold Contact Type:Stamped GENERAL INFORMATION Operating Temperature:-40 up to +105 °C Compliance:RoHS ELECTRICAL PROPERTIES: Rated Current:3 A IR 1:3 A Withstanding Voltage:500 V (AC) Contact Resistance:20 mΩ RISO:1000 MΩ CERTIFICATION UL Approval:E323964 PACKAGING PROPERTIES Packaging:Bag <https://katalog.we-online.com/media/images/v2/o33211v209%20Family_BTB_PHD_6130xx11121.jpg> Details see: https://katalog.we-online.com/en/em/PHD_2_54_THT_PIN_HEADER_6130XX11121 Updated by Yingchun,Shan 2019-10-16 2019 (C) Würth Elektronik; DATASHEET-URL: https://katalog.we-online.com/em/datasheet/61300411121.pdf; GENDER: Pin Header; IR: 3A; MATES: WR-PHD 2.54mm Angled Socket Header /SMT Socket Header/Socket Header; PACKAGING: Bag; PART-NUMBER: 61300411121; PINS: 4; ROWS: Single; TYPE: Straight
J3 = Wurth_Connectors_WR-PHD:6130XX11121_61300511121: WR-PHD 2.54 mm THT Pin Header ARTICLE PROPERTIES: Pins:1;​ 2;​ 3;​ 4;​ 5;​ 6;​ 7;​ 8;​ 9;​ 10;​ 12;​ 13;​ 14;​ 15;​ 16;​ 18;​ 20;​ 22;​ 24;​ 25;​ 32;​ 36;​ 40 KIND PROPERTIES: Pitch：2.54 mm Quality Class:3 as per CECC 75 301-802 Rows：Single Gender：Pin Header Type：Straight MATERIAL PROPERTIES: Insulator Material :PBT Insulator Flammability Rating:UL94 V-0 Contact Material:Copper Alloy Contact Plating:Gold Contact Type:Stamped GENERAL INFORMATION Operating Temperature:-40 up to +105 °C Compliance:RoHS ELECTRICAL PROPERTIES: Rated Current:3 A IR 1:3 A Withstanding Voltage:500 V (AC) Contact Resistance:20 mΩ RISO:1000 MΩ CERTIFICATION UL Approval:E323964 PACKAGING PROPERTIES Packaging:Bag <https://katalog.we-online.com/media/images/v2/o33211v209%20Family_BTB_PHD_6130xx11121.jpg> Details see: https://katalog.we-online.com/en/em/PHD_2_54_THT_PIN_HEADER_6130XX11121 Updated by Yingchun,Shan 2019-10-16 2019 (C) Würth Elektronik; DATASHEET-URL: https://katalog.we-online.com/em/datasheet/61300511121.pdf; GENDER: Pin Header; IR: 3A; MATES: WR-PHD 2.54mm Angled Socket Header /SMT Socket Header/Socket Header; PACKAGING: Bag; PART-NUMBER: 61300511121; PINS: 5; ROWS: Single; TYPE: Straight
J5 J9 = 6-pin-tht:6130XX21121_61300621121: WR-PHD 2.54 mm THT Dual Pin Header ARTICLE PROPERTIES: Pins:4;​ 6;​ 8;​ 10;​ 12;​ 14;​ 16;​ 18;​ 20;​ 22;​ 24;​ 26;​ 28;​ 30;​ 32;​ 34;​ 36;​ 40;​ 44;​ 64;​ 72;​ 80 KIND PROPERTIES: Pitch：2.54 mm Quality Class:3 as per CECC 75 301-802 Rows：Dual Gender：Pin Header Type：Board Stacker MATERIAL PROPERTIES: Insulator Material :PA6T Insulator Flammability Rating:UL94 V-0 Contact Material:Copper Alloy Contact Plating:Gold Contact Type:Stamped GENERAL INFORMATION Operating Temperature:-40 up to +105 °C Compliance:Lead free / RoHS ELECTRICAL PROPERTIES: Rated Current:3 A IR 1:3 A Withstanding Voltage:500 V (AC) Contact Resistance:20 mΩ RISO:1000 MΩ CERTIFICATION UL Approval:E323964 PACKAGING PROPERTIES Packaging:Bag <https://katalog.we-online.com/media/images/v2/o33215v209%20Family_WR-PHD_6130xx21121.jpg> Details see: https://katalog.we-online.com/en/em/PHD_2_54_THT_DUAL_PIN_HEADER_6130XX21121 Updated by Yingchun,Shan 2019-10-16 2019 (C) Würth Elektronik; DATASHEET-URL: https://katalog.we-online.com/em/datasheet/61300621121.pdf; GENDER: Pin Header; IR: 3A; MATES: WR-PHD 2.54mm Angled DualSocket Header/Dual Socket Header/Dual Socket Header Bottom Entry/Dual Socket Header Bottom Entry Large/SMT Dual Socket Header/SMT Dual Socket Header Bottom Entry; PACKAGING: Bag; PART-NUMBER: 61300621121; PINS: 6; ROWS: Dual; TYPE: Board Stacker
J6 J7 = Wurth_Connectors_WR-FAST:638207222005: WR-FAST 5.08 mm THT Male Header Vertical Blade 2863 KIND PROPERTIES Pitch 5.08 mm Gender Male MATERIAL PROPERTIES Insulator Material PC Insulator Flammability Rating UL94 V-0 Insulator Color Black Contact Material Steel Contact Plating Tin Contact Type Stamped GENERAL INFORMATION Operating Temperature -30 up to +120 °C Working Voltage 300 V (AC) Withstanding Voltage 1600 V (AC) Contact Resistance 20 mΩ RISO 5 MΩ IR 16 A CERTIFICATION cULus Approval E150931 PACKAGING PROPERTIES Packaging Box <https://www.we-online.com/catalog/media/o165124v209%20Family_ConFAST_638207222004.jpg> Details see: https://www.we-online.com/catalog/en/FAST_5_08_THT_MALE_VERTICAL_6382072220XX/ Updated by Ella Wu 2020-08-11 2020(C) Wurth Elektronik; CONTACT-RESISTANCE: 20mOhm; DATASHEET-URL: https://www.we-online.com/catalog/datasheet/638207222005.pdf; GENDER: Male; IR: 16A; MOUNT: THT; PART-NUMBER: 638207222005; PINS: 5; PITCH: 5.08mm; TYPE: Vertical; WORKING-VOLTAGE: 300V(AC)
R1-R7 R10 R13 R18 = resistor:R-EU_: RESISTOR, European symbol
RX1-RX4 = Wurth_Resistor_WRIS-KWKB:WRIS-KWKB_0612: WRIS-KWKB Thick Film Resistors High Power Current Sensing, Wide Terminal Characteristics Product series for high power current sensing up to 2 W Mounting style: SMT-Chip (wide terminal) Resistance range: 2.2 Ω ‒ 18 kΩ Resistance tolerance: ±1 %; ±5 % Rated Power: 0.75 W ‒ 2W TCR: ±200 ppm/°C Operating temperature: -55°C up to +155°C Sizes: 0612 / 1020 / 1225 Recommended soldering: Reflow soldering Applications Electric motor Camera Lighting control TV <https://katalog.we-online.com/media/images/v2/o135741v209%20Family_WRIS-KWKB.jpg> Details see: https://katalog.we-online.com/en/pbs/WRIS-KWKB Created by Ella Wu 2019-09-06 2019(C) Wurth Elektronik; DATASHEET-URL: https://katalog.we-online.de/pbs/datasheet/561020132023.pdf; IR: 39.9mA; MOUNT: SMT; PART-NUMBER: 561020132023; PRATED: 0.75W; TCR: ±200ppm/ °C; TECHNICAL-REFERENCE: KB06124700J304DAATP0000
U2 U3 = ITS4040DEPDXUMA1:ITS4040DEPDXUMA1: Power Switch/Driver 1:1 N-Channel 2.6A PG-TSDSO-14; DESCRIPTION: Power Switch/Driver 1:1 N-Channel 2.6A PG-TSDSO-14; DIGI-KEY_PART_NUMBER: ITS4040DEPDXUMA1TR-ND; MF: Infineon Technologies; MP: ITS4040DEPDXUMA1; PACKAGE: TSSOP-14 Infineon Technologies
U4 = TLE9250VSJ:TLE9250VSJ: TLE9250VSJ SOIC127P602X173-8N-V High Speed CAN FD Transceiver; ARTIKEL_NR: 545599
X1 = con-JST VH:S4P-VH: JST VH Series header 3.96mm pitch disconnectable crimp style connectors, horizontal (side entry type), 4 pins

## Net classes
1 GND: width 0.127 mm, clearance 0.127 mm to class 0